# Altium schematic sheet subRelayOut.SchDoc
size A4
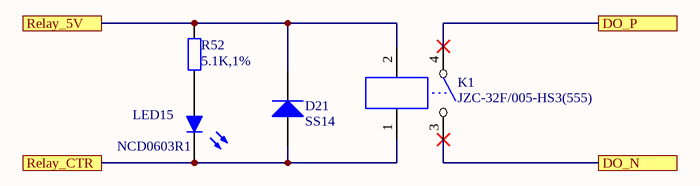
[diagram p0: subRelayOut.SchDoc]

## Parts
D21  SS14  [SMA_L4.4-W2.8-LS5.4-RD]
K1  JZC-32F/005-HS3(555)  [RELAY-TH_JZC-32F-XXXHXX]
LED15  NCD0603R1  [LED0603-RD]
R52  5.1K,1%  [R0603]

## Ports
DO_N, DO_P, Relay_5V, Relay_CTR

## Nets
DO_N: K1.3 ; port DO_N
DO_P: K1.4 ; port DO_P
Relay_5V: D21.2(K) K1.2 R52.1 ; port Relay_5V
Relay_CTR: D21.1(A) K1.1 LED15.1(K) ; port Relay_CTR
NetLED15_2: LED15.2(A) R52.2

## Library data of the parts
D21 = Diode: Default Diode; Published: 8-Jun-2000; LatestRevisionDate: 17-Jul-2002; LatestRevisionNote: Re-released for DXP Platform.; PackageVersion: Sep-1996; PackageReference: SMC; Publisher: Altium Limited; PackageDescription: DO-214-AB/SMC; 2 C-Bend Leads; Body 7.9 x 5.9 mm, inc. leads (LxW); Code_JEDEC: DO-214-AB
LED15 = LED0603: Typical INFRARED GaAs LED
R52 = 电阻: Value: 5.1K, 1%; Type: 贴片电阻